# Altium schematic sheet DAC.SchDoc: =TopTitle
size 420 x 297 mm; EDA_Number: ARTIQ; CheckedBy: -; Author: G.Kasprowicz; CompanyName: WUT ISE; DrawnBy: G.Kasprowicz; Organization: WUT ISE; Address1: PW ISE; Address2: Nowowiejska 15/19 00-665 Warsaw; Address3: gkasprow@gmail.com; SheetNumber: -; SheetTotal: -; ModifiedBy: -; CheckedDate: -; Title2: DAC; DivGrp: WUT ISE; Designer: G.Kasprowicz; ModifiedDate: -; ProjectName: Sensor Box
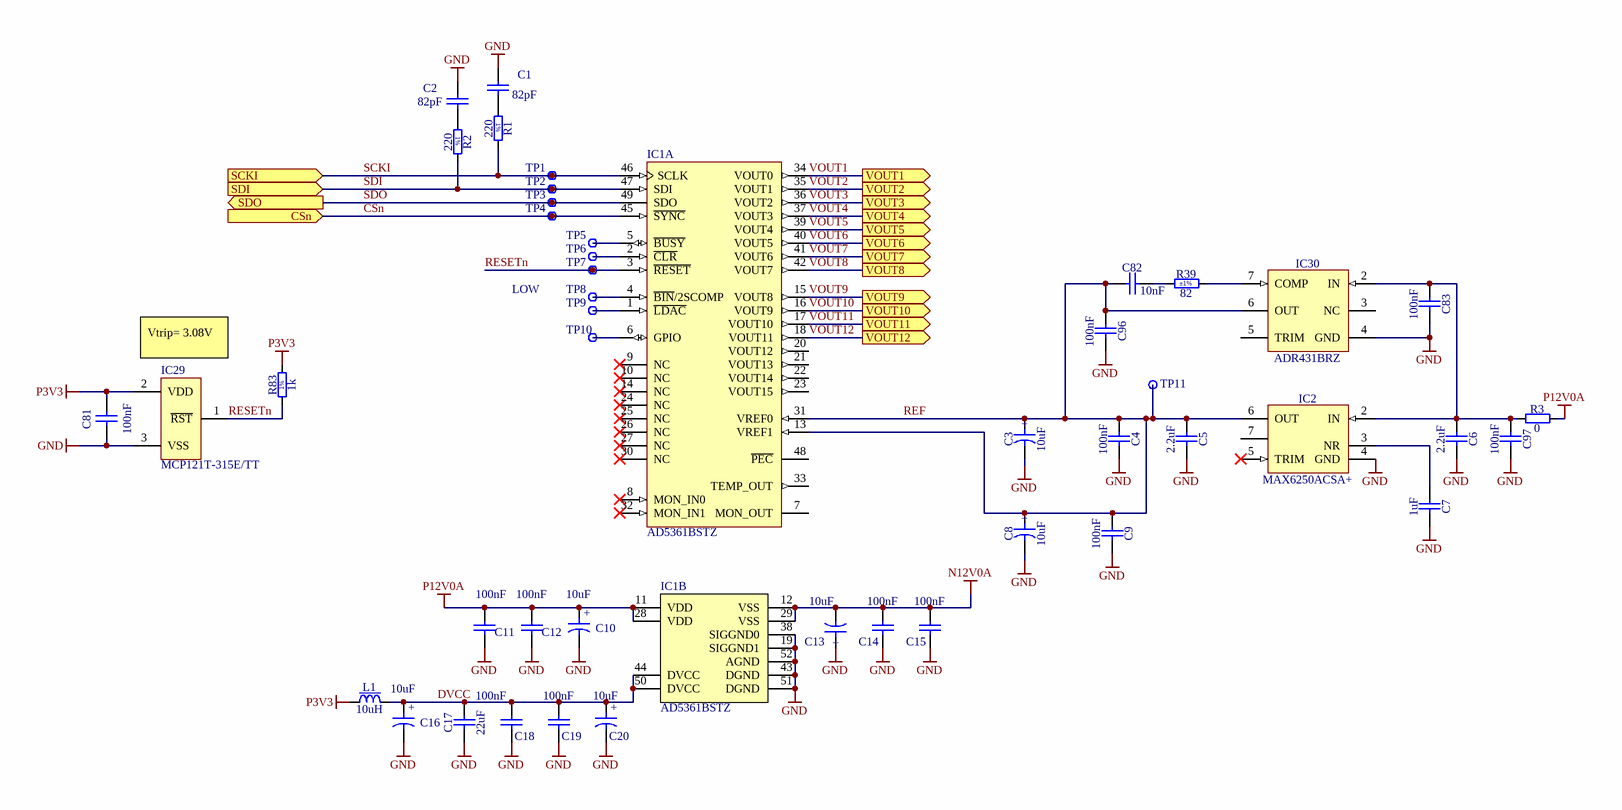
[diagram p0: DAC.SchDoc]

## Parts
C1  82pF  [CAPC1608X87N]
C2  82pF  [CAPC1608X87N]
C3  10uF  [CAPMP3216X180N]
C4  100nF  [CAPC1005X55N]
C5  2.2uF  [CAPC1608X87N]
C6  2.2uF  [CAPC1608X87N]
C7  1uF  [CAPC1608X87N]
C8  10uF  [CAPMP3216X180N]
C9  100nF  [CAPC1005X55N]
C10  10uF  [CAPMP3216X180N]
C11  100nF  [CAPC1005X55N]
C12  100nF  [CAPC1005X55N]
C13  10uF  [CAPMP3216X180N]
C14  100nF  [CAPC1005X55N]
C15  100nF  [CAPC1005X55N]
C16  10uF  [CAPMP3216X180N]
C17  22uF  [CAPC2012X135N]
C18  100nF  [CAPC1005X55N]
C19  100nF  [CAPC1005X55N]
C20  10uF  [CAPMP3216X180N]
C81  100nF  [CAPC1005X55N]
C82  10nF  [CAPC1005X55N]
C83  100nF  [CAPC1005X55N]
C96  100nF  [CAPC1005X55N]
C97  100nF  [CAPC1005X55N]
IC1  AD5361BSTZ  [ST-52_N]  (parts A,B of 2)
IC2  MAX6250ACSA+  [SOIC127P600X175-8N]
IC29  MCP121T-315E/TT  [SOT-23-TT3_L]
IC30  ADR431BRZ  [SOIC127P600X175-8N]
L1  10uH  [IND_MURATA-PS_8400]
R1  220  [RESC1608X55N]
R2  220  [RESC1608X55N]
R3  0  [RESC1005X40N]
R39  82  Tolerance: ±1%  [RESC1005X40N]
R83  1k  [RESC1005X40N]
TP1  Test Point  [TPS127]  (value not drawn)  (no BOM)
TP2  Test Point  [TPS127]  (value not drawn)  (no BOM)
TP3  Test Point  [TPS127]  (value not drawn)  (no BOM)
TP4  Test Point  [TPS127]  (value not drawn)  (no BOM)
TP5  Test Point  [TPS127]  (value not drawn)  (no BOM)
TP6  Test Point  [TPS127]  (value not drawn)  (no BOM)
TP7  Test Point  [TPS127]  (value not drawn)  (no BOM)
TP8  Test Point  [TPS127]  (value not drawn)  (no BOM)
TP9  Test Point  [TPS127]  (value not drawn)  (no BOM)
TP10  Test Point  [TPS127]  (value not drawn)  (no BOM)
TP11  Test Point  [TPS127]  (value not drawn)  (no BOM)

## Ports
CSn (in), SCKI (in), SDI (in), SDO (out), VOUT1 (out), VOUT2 (out), VOUT3 (out), VOUT4 (out), VOUT5 (out), VOUT6 (out), VOUT7 (out), VOUT8 (out), VOUT9 (out), VOUT10 (out), VOUT11 (out), VOUT12 (out)

## Nets
GND: C1.1 C2.1 C3.2 C4.1 C5.1 C6.1 C7.1 C8.2 C9.1 C10.2 C11.1 C12.1 C13.1 C14.1 C15.1 C16.2 C17.1 C18.1 C19.1 C20.2 C81.1 C83.1 C96.1 C97.1 IC1.19(SIGGND1) IC1.38(SIGGND0) IC1.43(DGND) IC1.51(DGND) IC1.52(AGND) IC2.4(GND) IC29.3(VSS) IC30.4(GND)
N12V0A: C13.2 C14.2 C15.2 IC1.12(VSS) IC1.29(VSS)
P3V3: C81.2 IC29.2(VDD) L1.1 R83.2
P12V0A: C10.1 C11.2 C12.2 IC1.11(VDD) IC1.28(VDD) R3.1
CSn: IC1.45(~{SYNC}) TP4.1 ; port CSn
DVCC: C16.1 C17.2 C18.2 C19.2 C20.1 IC1.44(DVCC) IC1.50(DVCC) L1.2
REF: C3.1 C4.2 C5.2 C8.1 C9.2 C82.1 C96.2 IC1.13(VREF1) IC1.31(VREF0) IC2.6(OUT) IC30.6(OUT) TP11.1
RESETn: IC1.3(~{RESET}) IC29.1(~{RST}) R83.1 TP7.1
SCKI: IC1.46(SCLK) R1.2 TP1.1 ; port SCKI
SDI: IC1.47(SDI) R2.2 TP2.1 ; port SDI
SDO: IC1.49(SDO) TP3.1 ; port SDO
VOUT1: IC1.34(VOUT0) ; port VOUT1
VOUT2: IC1.35(VOUT1) ; port VOUT2
VOUT3: IC1.36(VOUT2) ; port VOUT3
VOUT4: IC1.37(VOUT3) ; port VOUT4
VOUT5: IC1.39(VOUT4) ; port VOUT5
VOUT6: IC1.40(VOUT5) ; port VOUT6
VOUT7: IC1.41(VOUT6) ; port VOUT7
VOUT8: IC1.42(VOUT7) ; port VOUT8
VOUT9: IC1.15(VOUT8) ; port VOUT9
VOUT10: IC1.16(VOUT9) ; port VOUT10
VOUT11: IC1.17(VOUT10) ; port VOUT11
VOUT12: IC1.18(VOUT11) ; port VOUT12
NetC1_2: C1.2 R1.1
NetC2_2: C2.2 R2.1
NetC6_2: C6.2 C83.2 C97.2 IC2.2(IN) IC30.2(IN) R3.2
NetC7_2: C7.2 IC2.3(NR)
NetC82_2: C82.2 R39.1
NetIC1_1: IC1.1(~{LDAC}) TP9.1
NetIC1_2: IC1.2(~{CLR}) TP6.1
NetIC1_4: IC1.4(~{BIN}/2SCOMP) TP8.1
NetIC1_5: IC1.5(~{BUSY}) TP5.1
NetIC1_6: IC1.6(GPIO) TP10.1
NetIC30_7: IC30.7(COMP) R39.2

Not connected (* = marked no-connect by the designer): IC1 7(MON_OUT) 8(MON_IN0)* 9(NC)* 10(NC)* 14(NC)* 20(VOUT12) 21(VOUT13) 22(VOUT14) 23(VOUT15) 24(NC)* 25(NC)* 26(NC)* 27(NC)* 30(NC)* 32(MON_IN1)* 33(TEMP_OUT) 48(~{PEC}); IC2 5(TRIM)* 7; IC30 3(NC) 5(TRIM)

## Notes on the sheet
- LOW
- (near IC29) Vtrip= 3.08V
- Project/Equipment
- Document
- Designer
- Drawn by
- Check.by
- Copyright WUT ISE 2020.
  This documentation describes Open Hardware and is licensed under the CERN OHL v.1.2. You may redistribute and modify this documentation under the terms of the CERN OHL v.1.2. (http://ohwr.org/CERNOHL). This documentation is distributed WITHOUT ANY EXPRESS OR IMPLIED WARRANTY, INCLUDING OF MERCHANTABILITY, SATISFACTORY QUALITY AND FITNESS FOR A PARTICULAR PURPOSE. Please see the CERN OHL v.1.2 for applicable conditions.
- Contact
- File
- Last Mod.
- Print Date
- Sheet
- Size
- A3
- of
- Rev
- (in symbol CTE3216-18_10UF_16V_20%_AVX_TCJ) +
- (in symbol R0402_1K_1%_0.0625W_100PPM) 1%
- (in symbol R0603_220R_1%_0.1W_100PPM) 1%

## Library data of the parts
C1 C2 = CC0603_82PF_50V_5%_NP0: Non-polarised capacitor; Part Description: SMD Multilayer Chip Ceramic Capacitor; Manufacturer: GENERIC; Manufacturer1 Part Number: 223886715829; Voltage: 50V; TC: C0G/NP0; Tolerance: ±5%; Part Number: CC0603_82PF_50V_5%_NP0; Component Kind: Standard; Component Type: Standard; Pin Count: 2; Value: 82pF; Status: Preferred; Manufacturer Part Number: CC0603_82PF_50V_5%_NP0; Case: 0603; Mounted: Yes; Socket: No; SMD: Yes; Sense: No; Manufacturer1 Example: PHYCOMP; Manufacturer1 ComponentHeight: 0.87mm; HelpURL: \\cern.ch\dfs\Applications\Altium\Datasheets\CC0603_NP0_PHYCOMP.pdf; Author: CERN DEM JLC; CreateDate: 03.12.2007; LatestRevisionDate: 03.12.2007
C3 C8 C10 C13 C16 C20 = CTE3216-18_10UF_16V_20%_AVX_TCJ: Polarised capacitor; Part Description: ESR 0R200 Tantalum Solid Electrolytic Chip Capacitor with Conductive Polymer Electrode; Manufacturer: AVX; Manufacturer Part Number: TCJA106M016R0200; Voltage: 16V; Tolerance: ±20%; Part Number: CTE3216-18_10UF_16V_20%_AVX_TCJ; Component Kind: Standard; Component Type: Standard; Pin Count: 2; Value: 10uF; Status: Preferred; Case: A; Mounted: Yes; Socket: No; SMD: Yes; Sense: No; ComponentHeight: 1.8mm; HelpURL: \\cern.ch\dfs\Applications\Altium\Datasheets\CTE_AVX_TCJ.pdf; Author: CERN DEM JLC; CreateDate: 29.03.2012; LatestRevisionDate: 29.03.2012
C4 C9 C11 C12 C14 C15 C18 C19 C81 C83 C96 C97 = CC0402_100NF_16V_10%_X7R: Non-polarised capacitor; Part Description: SMD Multilayer Chip Ceramic Capacitor; Manufacturer: GENERIC; Manufacturer1 Part Number: GRM155R71C104KA88D; Voltage: 16V; TC: X7R; Tolerance: ±10%; Part Number: CC0402_100NF_16V_10%_X7R; Component Kind: Standard; Component Type: Standard; Pin Count: 2; Value: 100nF; Status: Not Recommended; Manufacturer Part Number: CC0402_100NF_16V_10%_X7R; Case: 0402; Mounted: Yes; Socket: No; SMD: Yes; Sense: No; Manufacturer1 Example: MURATA; Manufacturer1 ComponentHeight: 0.55mm; HelpURL: \\cern.ch\dfs\Applications\Altium\Datasheets\CC0402_X7R_MURATA_GRM.pdf; Author: CERN DEM JLC
  C4 C9 C83 C96 C97: CreateDate: 2013-12-05; LatestRevisionDate: 2007-12-03
  C11 C12 C14 C15 C18 C19: CreateDate: 05.12.2013; LatestRevisionDate: 03.12.2007
  C81: CreateDate: 05/12/2013; LatestRevisionDate: 03/12/2007
C5 C6 = CC0603_2.2UF_16V_10%_X5R: Non-polarised capacitor; Part Description: SMD Multilayer Chip Ceramic Capacitor; Manufacturer: GENERIC; Manufacturer1 Part Number: CC0603KRX5R7BB225; Voltage: 16V; TC: X5R; Tolerance: ±10%; Part Number: CC0603_2.2UF_16V_10%_X5R; Component Kind: Standard; Component Type: Standard; Pin Count: 2; Value: 2.2uF; Status: Preferred; Manufacturer Part Number: CC0603_2.2UF_16V_10%_X5R; Case: 0603; Mounted: Yes; Socket: No; SMD: Yes; Sense: No; Manufacturer1 Example: YAGEO; Manufacturer1 ComponentHeight: 0.9mm; HelpURL: \\cern.ch\dfs\Applications\Altium\Datasheets\CC0805_X5R_PHYCOMP_HC.pdf; Author: CERN DEM JLC; CreateDate: 28.04.2011; LatestRevisionDate: 28.04.2011
C7 = CC0603_1UF_25V_10%_X7R: Non-polarised capacitor; Part Description: SMD Multilayer Chip Ceramic Capacitor; Manufacturer: GENERIC; Manufacturer1 Part Number: GRM188R71E105KA12D; Voltage: 25V; TC: X7R; Tolerance: ±10%; Part Number: CC0603_1UF_25V_10%_X7R; Component Kind: Standard; Component Type: Standard; Pin Count: 2; Value: 1uF; Status: None; Manufacturer Part Number: CC0603_1UF_25V_10%_X7R; Case: 0603; Mounted: Yes; Socket: No; SMD: Yes; Sense: No; Manufacturer1 Example: MURATA; Manufacturer1 ComponentHeight: 0.9mm; HelpURL: \\cern.ch\dfs\Applications\Altium\Datasheets\CC0603_X7R_MURATA.pdf; Author: CERN DEM JLC; CreateDate: 18.01.2011; LatestRevisionDate: 18.01.2011
C17 = CC0805_22UF_16V_10%_X5R: Non-polarised capacitor; Part Description: SMD Multilayer Chip Ceramic Capacitor; Manufacturer: GENERIC; Manufacturer1 Part Number: C2012X5R1C226KT; Voltage: 16V; TC: X5R; Tolerance: ±10%; Part Number: CC0805_22UF_16V_10%_X5R; Component Kind: Standard; Component Type: Standard; Pin Count: 2; Value: 22uF; Status: Preferred; Manufacturer Part Number: CC0805_22UF_16V_10%_X5R; Case: 0805; Mounted: Yes; Socket: No; SMD: Yes; Sense: No; Manufacturer1 Example: TDK; Manufacturer1 ComponentHeight: 1.35mm; HelpURL: \\cern.ch\dfs\Applications\Altium\Datasheets\CC0805_X5R_TDK_C.pdf; Author: CERN DEM JLC; CreateDate: 25.10.2012; LatestRevisionDate: 25.10.2012
C82 = CC0402_10NF_16V_10%_X7R: Non-polarised capacitor; Part Description: SMD Multilayer Chip Ceramic Capacitor; Manufacturer: GENERIC; Manufacturer1 Part Number: 223878715636; Voltage: 16V; TC: X7R; Tolerance: ±10%; Part Number: CC0402_10NF_16V_10%_X7R; Component Kind: Standard; Component Type: Standard; Pin Count: 2; Value: 10nF; Status: Not Recommended; Manufacturer Part Number: CC0402_10NF_16V_10%_X7R; Case: 0402; Mounted: Yes; Socket: No; SMD: Yes; Sense: No; Manufacturer1 Example: PHYCOMP; Manufacturer1 ComponentHeight: 0.55mm; HelpURL: \\cern.ch\dfs\Applications\Altium\Datasheets\CC0402_X7R_PHYCOMP.pdf; Author: CERN DEM JLC; CreateDate: 03.12.2007; LatestRevisionDate: 03.12.2007
IC1 = CMP-0318-00792-2: 14-Bit Digital-to-Analog Converter with Serial Interface, -40 to +85 degC, ST-52, Pb-Free, Tray; Generic Part Number: AD5361; Manufacturer: Analog Devices; Max V+: 16.5V; Resolution (Bits): 14; Single Supply: No; Settling Time: 20Âµs; # DAC Outputs: 16; Op Pwr Diss: 130mW; PackageVersion: 2003; PackageDescription: 52-Lead Low Profile Quad Flat Package [LQFP]; RevisionNote: Component URL fixed; ComponentLink2Description: Datasheet; ComponentLink3URL: http://www.analog.com/static/imported-files/packages/61012411624300842189414155189544791816408612ST_52_10x10.pdf; ComponentLink2URL: http://www.analog.com/static/imported-files/data_sheets/AD5360_5361.pdf; Manufacturer Part Number: AD5361BSTZ; ComponentLink3Description: Package Specification; Mounting Technology: Surface Mount; DatasheetVersion: Rev.A; ComponentLink1Description: Manufacturer URL; ComponentLink4Description: Product URL; RoHS: Y; ComponentLink4URL: http://www.analog.com/en/digital-to-analog-converters/da-converters/ad5361/products/product.html; ComponentLink1URL: http://www.analog.com/en/index.html; Code_JEDEC: MS-026-BCC; Packing: Tray; PackageReference: ST-52
IC2 = MAX6250ACSA+: 1ppm/°C, Low-Noise, Precision, +5.000V Voltage Reference; Manufacturer: MAXIM; PressFit: No; Bonding: No; Part Number: MAX6250ACSA+; Component Kind: Standard; Component Type: Standard; Device: MAX6250ACSA+; PackageDescription: SOIC 8, Pitch 1.27mm, Body 4x5mm, IPC Medium Density; Part Description: 1ppm/°C, Low-Noise, Precision, +5.000V Voltage Reference; Manufacturer Part Number: MAX6250ACSA+; Pin Count: 5; Case: SOIC8; Mounted: Yes; Socket: No; SMD: Yes; Sense: No; ComponentHeight: 1.75mm; HelpURL: \\cern.ch\dfs\Applications\Altium\Datasheets\MAX6250ACSA+.pdf; Author: CERN DEM JMW; CreateDate: 06.07.2015; LatestRevisionDate: 06.07.2015
IC29 = CMP-0138-00412-1: Micropower Voltage Supervisors, 3-Pin SOT-23, Extended Temperature, Tape and Reel; PackageReference: SOT-23-TT3; PackageVersion: revBB, Aug-2009; DatasheetVersion: revB, Mar-2005; Code_IPC: SOT23-3; PackageDescription: 3-Lead Plastic Small Outline Transistor (TT) [SOT-23]
IC30 = ADR431BRZ: 2.5V ±0.12% 10ppm/°C Ultralow Noise XFET Voltage References with Current Sink and Source Capability; Part Description: 2.5V Output,  1mV ±0.04% Accuracy, 3ppm/°C Ultralow Noise XFET Voltage References with Current Sink and Source Capability; Manufacturer: ANALOG DEVICES; PressFit: No; Bonding: No; Part Number: ADR431BRZ; Component Kind: Standard; Component Type: Standard; Device: ADR431BRZ; PackageDescription: SOIC 8, Pitch 1.27mm, Body 4x5mm, IPC Medium Density; Manufacturer Part Number: ADR431BR; Pin Count: 6; Case: SOIC8; Mounted: Yes; Socket: No; SMD: Yes; Sense: No; ComponentHeight: 1.75mm; HelpURL: \\cern.ch\dfs\Applications\Altium\Datasheets\ADR431BRZ.pdf; Author: CERN DEM JLC; CreateDate: 29.10.2013; LatestRevisionDate: 04.04.2022
L1 = IND_10UH_10%_MURATA-PS_8400: Inductor With Core; Part Description: Miniature Surface Mount Power Inductor (8400 Serie); Manufacturer: MURATA POWER SOLUTIONS; Manufacturer Part Number: 84103C; Power: 950mA; Resistance: 0.24R; Tolerance: ±10%; Part Number: IND_10UH_10%_MURATA-PS_8400; Component Kind: Standard; Component Type: Standard; Pin Count: 2; Value: 10uH; Status: None; Mounted: Yes; Socket: No; SMD: Yes; Sense: No; ComponentHeight: 2.9mm; HelpURL: \\cern.ch\dfs\Applications\Altium\Datasheets\IND_MURATA-PS_8400.pdf; Author: CERN DEM JLC; CreateDate: 02.07.2012; LatestRevisionDate: 02.07.2012
R1 R2 = R0603_220R_1%_0.1W_100PPM: Resistor - 1%; Part Description: General Purpose Thick Film Chip Resistor; Manufacturer: GENERIC; Manufacturer1 Part Number: NRC06F2200TRF; Power: 0.1W; TC: ±100ppm/°C; Part Number: R0603_220R_1%_0.1W_100PPM; Component Kind: Standard; Component Type: Standard; Pin Count: 2; Value: 220; Status: Preferred; Tolerance: ±1%; Manufacturer Part Number: R0603_220R_1%_0.1W_100PPM; Case: 0603; Mounted: Yes; Sense: No; Socket: No; SMD: Yes; Manufacturer1 Example: NIC COMPONENT; Manufacturer1 ComponentHeight: 0.55mm; HelpURL: \\cern.ch\dfs\Applications\Altium\Datasheets\R0603_NIC_NRC.pdf; Author: CERN DEM JLC; CreateDate: 03.12.2007; LatestRevisionDate: 13.03.2008
R3 = R0402_0R_JUMPER: Resistor; Part Description: 1A (0.05R Max DC Resistance) Zero Ohm Jumper; Manufacturer: GENERIC; Manufacturer1 Part Number: 232270591001L; Part Number: R0402_0R_JUMPER; Component Kind: Standard; Component Type: Standard; Pin Count: 2; Value: 0; Status: Not recommended; Manufacturer Part Number: R0402_0R_JUMPER; Case: 0402; Mounted: Yes; Sense: No; Socket: No; SMD: Yes; Manufacturer1 Example: YAGEO PHYCOMP; Manufacturer1 ComponentHeight: 0.4mm; HelpURL: \\cern.ch\dfs\Applications\Altium\Datasheets\R0402_Phycomp_RC0402.pdf; Author: CERN DEM JLC; CreateDate: 03.12.2007; LatestRevisionDate: 17.10.2012
R39 = R0402_82R_1%_0.0625W_100PPM: Resistor - 1%; Part Description: General Purpose Thick Film Chip Resistor; Manufacturer: GENERIC; Manufacturer1 Part Number: 232270678209L; TC: ±100ppm/°C; PressFit: No; Part Number: R0402_82R_1%_0.0625W_100PPM; Component Kind: Standard; Component Type: Standard; Pin Count: 2; Value: 82; Status: Not Recommended; Power: 0.0625W; Manufacturer Part Number: R0402_82R_1%_0.0625W_100PPM; Case: 0402; Mounted: Yes; Sense: No; Socket: No; SMD: Yes; Manufacturer1 Example: YAGEO PHYCOMP; Manufacturer1 ComponentHeight: 0.4mm; HelpURL: \\cern.ch\dfs\Applications\Altium\Datasheets\R0402_Phycomp_RC0402.pdf; Author: CERN DEM JLC; CreateDate: 03.12.2007; LatestRevisionDate: 17.10.2012
R83 = R0402_1K_1%_0.0625W_100PPM: Resistor - 1%; Part Description: General Purpose Thick Film Chip Resistor; Manufacturer: GENERIC; Manufacturer1 Part Number: 232270671002L; TC: ±100ppm/°C; PressFit: No; Part Number: R0402_1K_1%_0.0625W_100PPM; Component Kind: Standard; Component Type: Standard; Pin Count: 2; Value: 1k; Status: Not Recommended; Power: 0.0625W; Tolerance: ±1%; Manufacturer Part Number: R0402_1K_1%_0.0625W_100PPM; Case: 0402; Mounted: Yes; Sense: No; Socket: No; SMD: Yes; Manufacturer1 Example: YAGEO PHYCOMP; Manufacturer1 ComponentHeight: 0.4mm; HelpURL: \\cern.ch\dfs\Applications\Altium\Datasheets\R0402_Phycomp_RC0402.pdf; Author: CERN DEM JLC; CreateDate: 03.12.2007; LatestRevisionDate: 17.10.2012; ClassName: Artix
TP1-TP11 = SMD_PAD_1.27X1.27MM: Part Description: 1.27mm x 1.27mm PCB Copper Area (SMD Test Point); Mounted: No; Part Number: SMD_PAD_1.27X1.27MM; Component Type: Standard (No BOM); Pin Count: 1; Family: Test Point; Socket: No; SMD: Yes; Sense: No; Status: None; ComponentHeight: 0mm; HelpURL: Undefined; Author: CERN DEM JLC; CreateDate: 12.01.2008; LatestRevisionDate: 12.01.2008; PackageDescription: 1.27mm x 1.27mm PCB Copper Area (SMD Test Point)